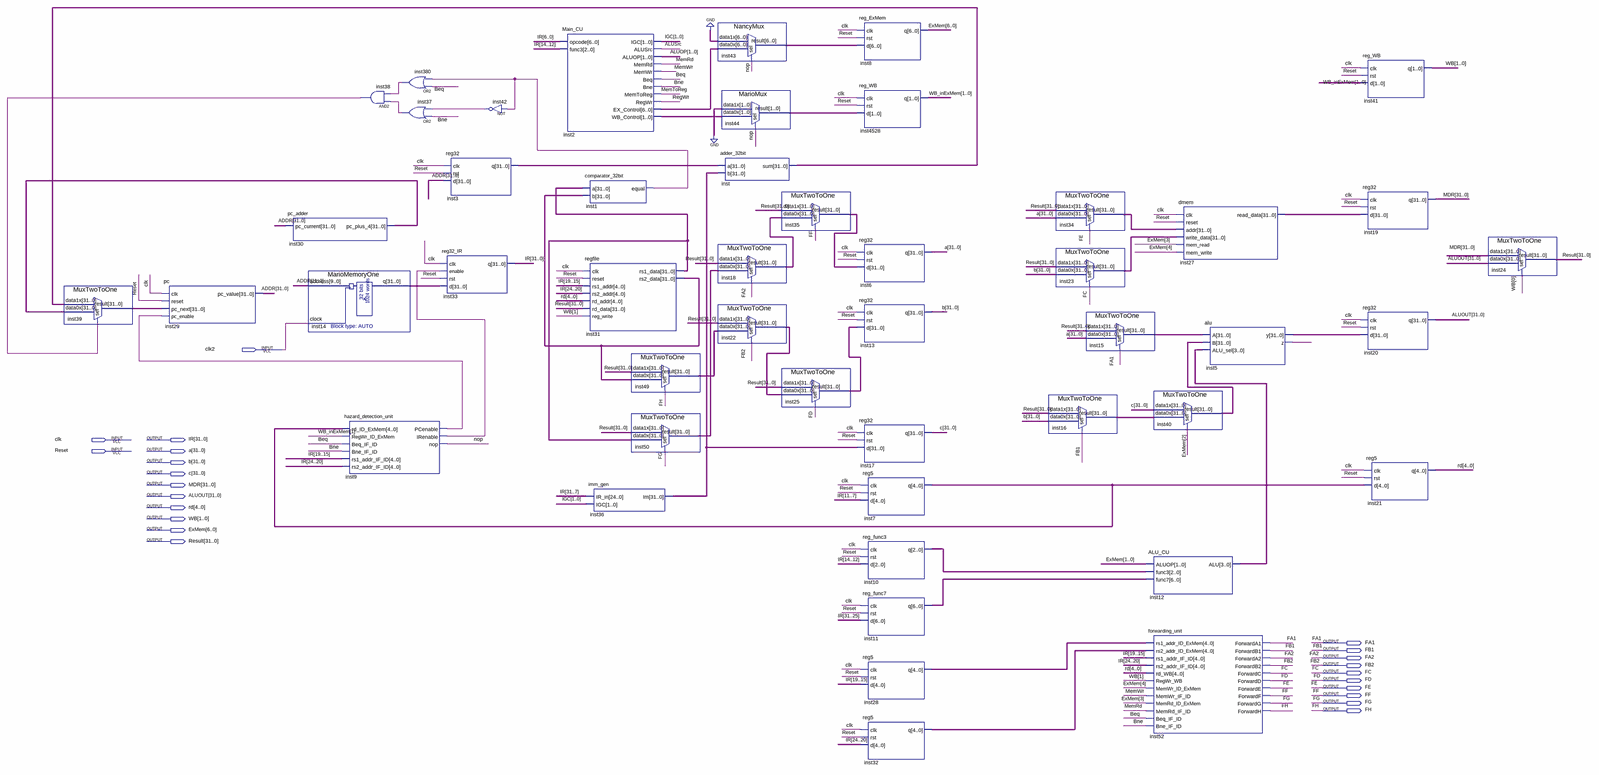
[diagram p0: schematic sheet, whole]
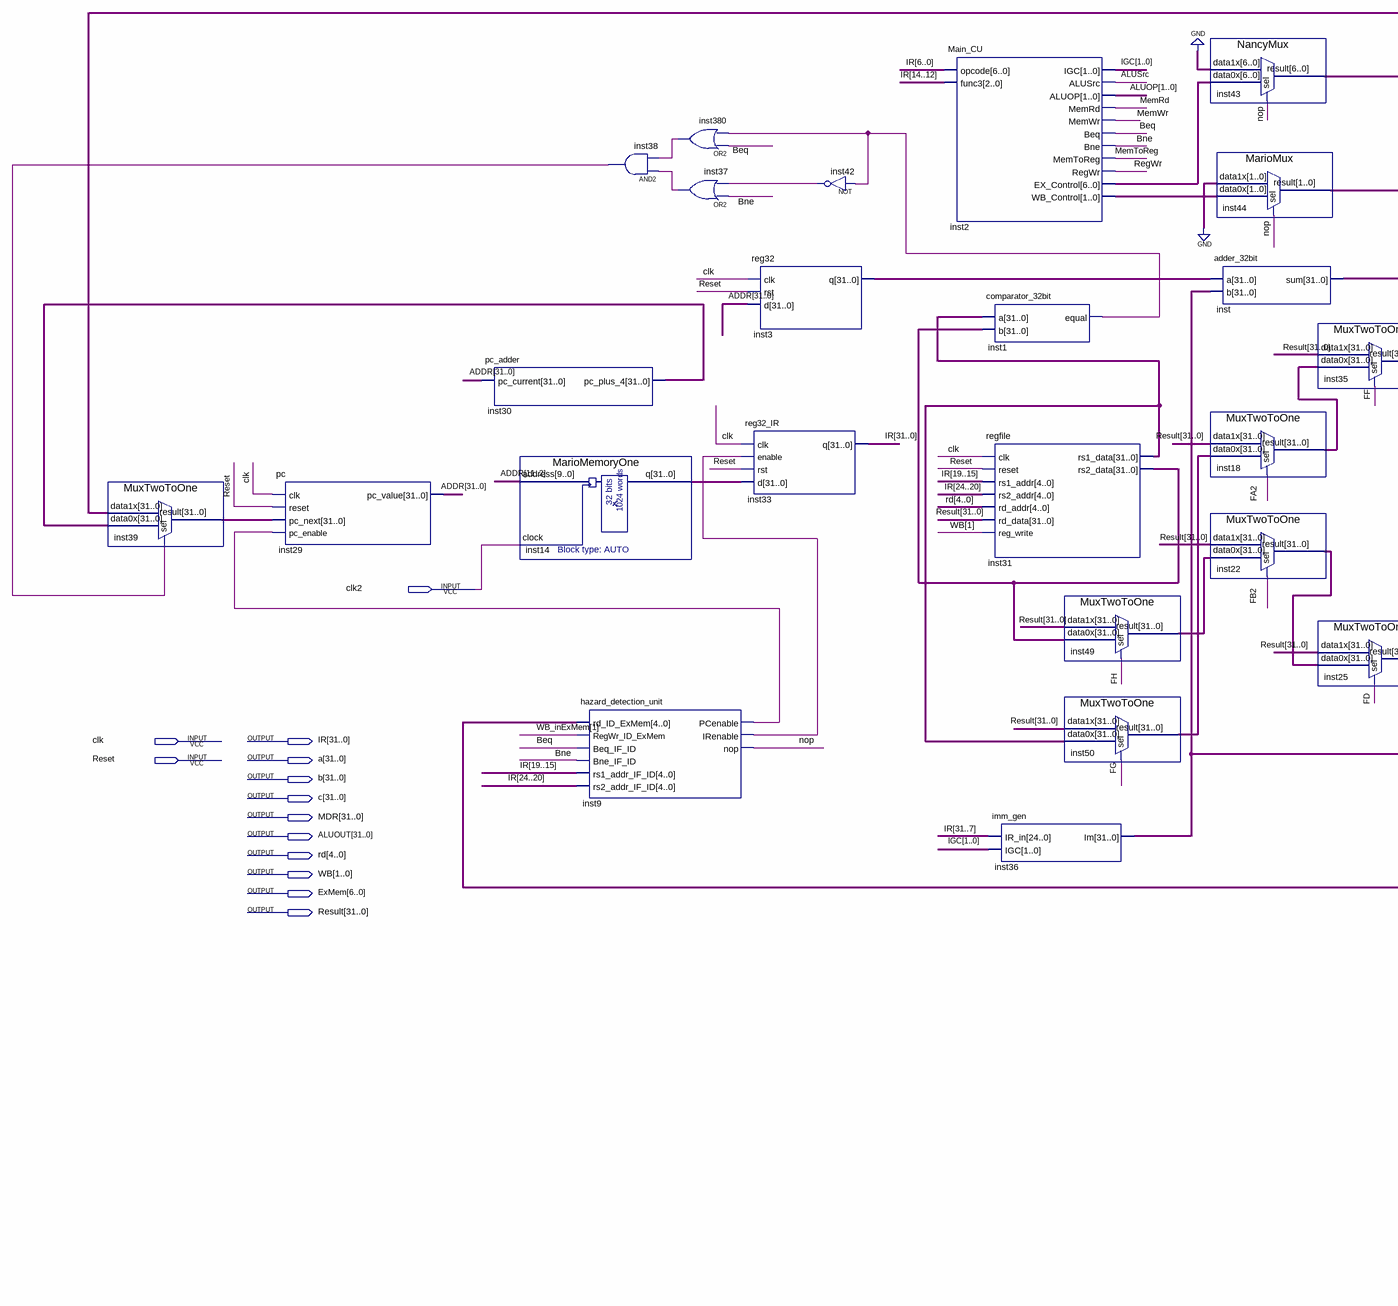
[diagram p1: schematic sheet, left part]
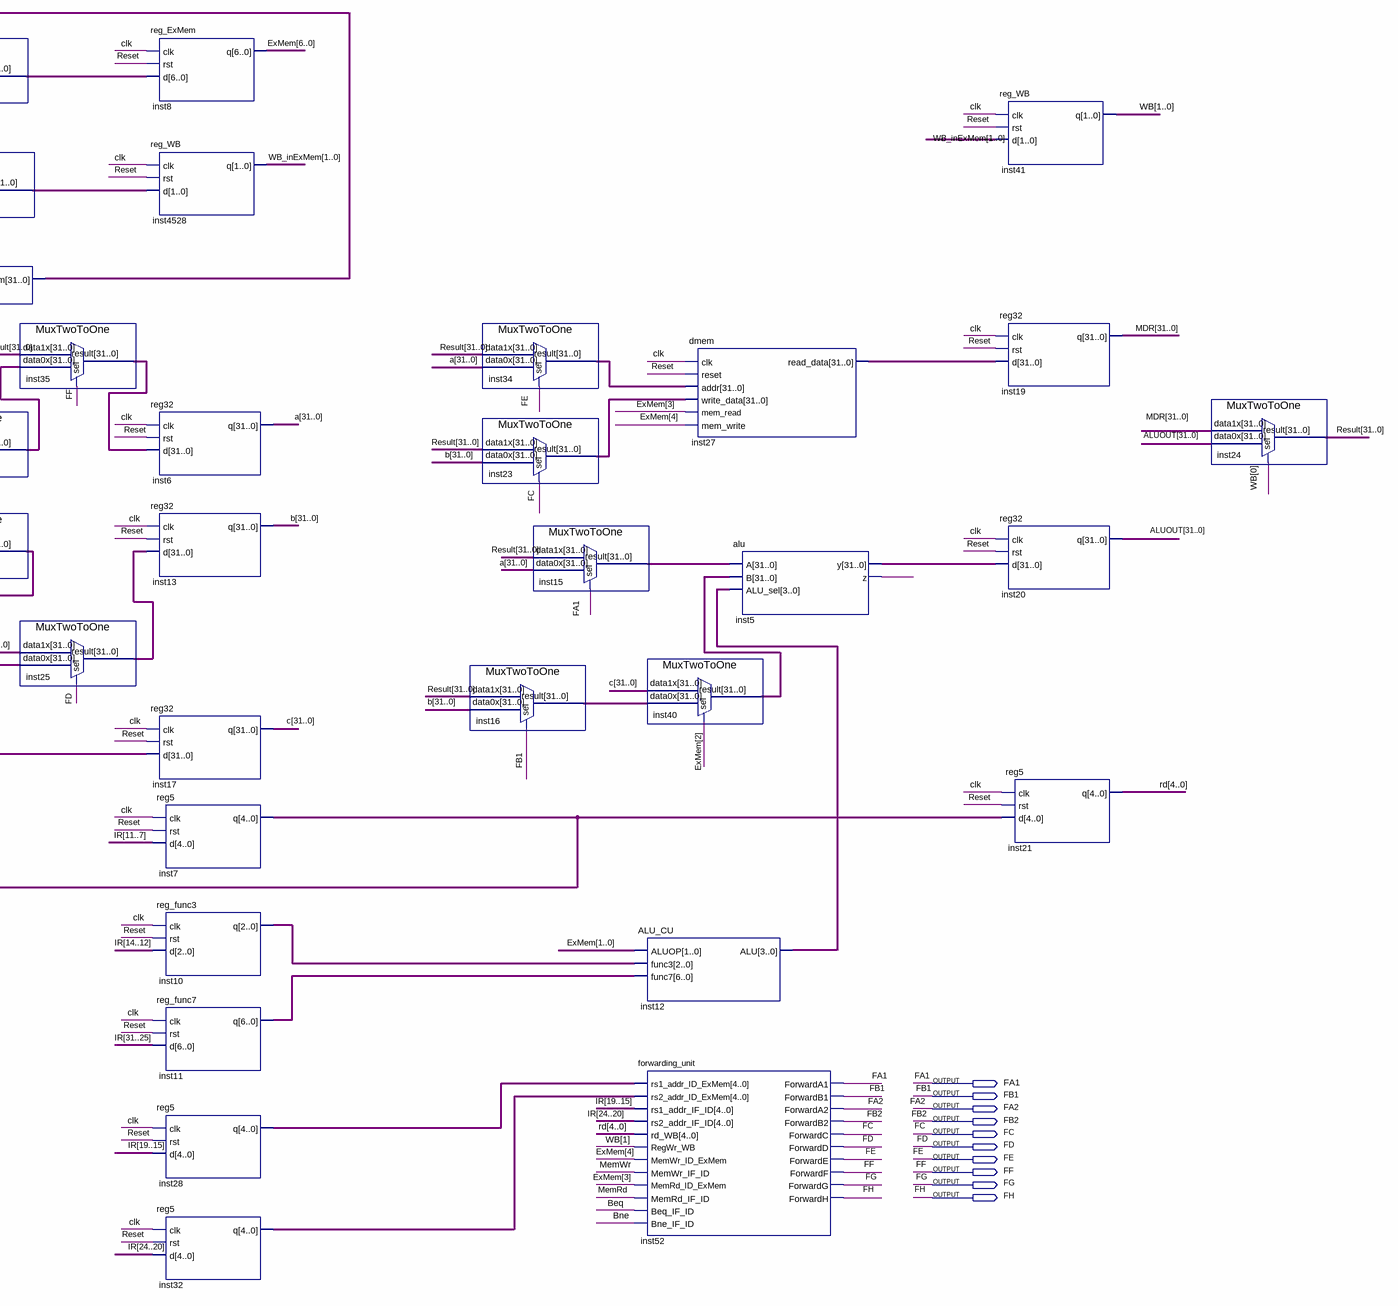
[diagram p2: schematic sheet, right part]
// Quartus schematic Project.bdf as structural Verilog: 48 symbols, 23 pins
module Project (
  input  clk2,
  input  clk,
  input  Reset,
  output [31:0] IR,
  output [31:0] a,
  output [31:0] b,
  output [31:0] c,
  output [31:0] MDR,
  output [31:0] ALUOUT,
  output [4:0] rd,
  output [1:0] WB,
  output [6:0] ExMem,
  output [31:0] Result,
  output FA1,
  output FB1,
  output FA2,
  output FB2,
  output FC,
  output FD,
  output FE,
  output FF,
  output FG,
  output FH
);

  wire ALUSrc, Beq, Bne, inst1_equal, inst5_z, inst9_irenable, inst9_pcenable, inst37_out, inst38_out,
       inst42_out, inst380_out, MemRd, MemToReg, MemWr, nop, RegWr;
  wire [1:0] ALUOP, IGC, inst2_wb_control, inst44_result, WB_inExMem;
  wire [2:0] inst10_q;
  wire [3:0] inst12_alu;
  wire [4:0] inst7_q, inst28_q, inst32_q;
  wire [6:0] inst2_ex_control, inst11_q, inst43_result;
  wire [31:0] ADDR, inst3_q, inst5_y, inst14_q, inst15_result, inst16_result, inst18_result, inst22_result,
       inst23_result, inst25_result, inst27_read_data, inst30_pc_plus_4, inst31_rs1_data, inst31_rs2_data,
       inst34_result, inst35_result, inst36_im, inst39_result, inst40_result, inst49_result, inst50_result,
       inst_sum;

  MuxTwoToOne inst39 (.data1x(inst_sum), .data0x(inst30_pc_plus_4), .sel(inst38_out), .result(inst39_result));
  pc inst29 (.clk(clk), .reset(Reset), .pc_next(inst39_result), .pc_enable(inst9_pcenable), .pc_value(ADDR));
  pc_adder inst30 (.pc_current(ADDR), .pc_plus_4(inst30_pc_plus_4));
  MarioMemoryOne inst14 (.address(ADDR[11:2]), .clock(clk2), .q(inst14_q));
  and inst38 (inst38_out, inst37_out, inst380_out);
  hazard_detection_unit inst9 (
    .rd_ID_ExMem(inst7_q), .RegWr_ID_ExMem(WB_inExMem[1]), .Beq_IF_ID(Beq), .Bne_IF_ID(Bne),
    .rs1_addr_IF_ID(IR[19:15]), .rs2_addr_IF_ID(IR[24:20]), .PCenable(inst9_pcenable),
    .IRenable(inst9_irenable), .nop(nop));
  or inst380 (inst380_out, Beq, inst1_equal);
  or inst37 (inst37_out, Bne, inst42_out);
  reg32 inst3 (.clk(clk), .rst(Reset), .d(ADDR), .q(inst3_q));
  reg32_IR inst33 (.clk(clk), .enable(inst9_irenable), .rst(Reset), .d(inst14_q), .q(IR));
  not inst42 (inst42_out, inst1_equal);
  Main_CU inst2 (
    .opcode(IR[6:0]), .func3(IR[14:12]), .IGC(IGC), .ALUSrc(ALUSrc), .ALUOP(ALUOP), .MemRd(MemRd),
    .MemWr(MemWr), .Beq(Beq), .Bne(Bne), .MemToReg(MemToReg), .RegWr(RegWr), .EX_Control(inst2_ex_control),
    .WB_Control(inst2_wb_control));
  comparator_32bit inst1 (.a(inst31_rs1_data), .b(inst31_rs2_data), .equal(inst1_equal));
  regfile inst31 (
    .clk(clk), .reset(Reset), .rs1_addr(IR[19:15]), .rs2_addr(IR[24:20]), .rd_addr(rd), .rd_data(Result),
    .reg_write(WB[1]), .rs1_data(inst31_rs1_data), .rs2_data(inst31_rs2_data));
  imm_gen inst36 (.IR_in(IR[31:7]), .IGC(IGC), .Im(inst36_im));
  MuxTwoToOne inst49 (.data1x(Result), .data0x(inst31_rs2_data), .sel(FH), .result(inst49_result));
  MuxTwoToOne inst50 (.data1x(Result), .data0x(inst31_rs1_data), .sel(FG), .result(inst50_result));
  NancyMux inst43 (.data1x({7{1'b0}}), .data0x(inst2_ex_control), .sel(nop), .result(inst43_result));
  MarioMux inst44 (.data1x(2'b00), .data0x(inst2_wb_control), .sel(nop), .result(inst44_result));
  adder_32bit inst (.a(inst3_q), .b(inst36_im), .sum(inst_sum));
  MuxTwoToOne inst18 (.data1x(Result), .data0x(inst50_result), .sel(FA2), .result(inst18_result));
  MuxTwoToOne inst22 (.data1x(Result), .data0x(inst49_result), .sel(FB2), .result(inst22_result));
  MuxTwoToOne inst35 (.data1x(Result), .data0x(inst18_result), .sel(FF), .result(inst35_result));
  MuxTwoToOne inst25 (.data1x(Result), .data0x(inst22_result), .sel(FD), .result(inst25_result));
  reg_ExMem inst8 (.clk(clk), .rst(Reset), .d(inst43_result), .q(ExMem));
  reg_WB inst4528 (.clk(clk), .rst(Reset), .d(inst44_result), .q(WB_inExMem));
  reg32 inst6 (.clk(clk), .rst(Reset), .d(inst35_result), .q(a));
  reg32 inst13 (.clk(clk), .rst(Reset), .d(inst25_result), .q(b));
  reg32 inst17 (.clk(clk), .rst(Reset), .d(inst36_im), .q(c));
  reg5 inst7 (.clk(clk), .rst(Reset), .d(IR[11:7]), .q(inst7_q));
  reg_func3 inst10 (.clk(clk), .rst(Reset), .d(IR[14:12]), .q(inst10_q));
  reg_func7 inst11 (.clk(clk), .rst(Reset), .d(IR[31:25]), .q(inst11_q));
  reg5 inst28 (.clk(clk), .rst(Reset), .d(IR[19:15]), .q(inst28_q));
  reg5 inst32 (.clk(clk), .rst(Reset), .d(IR[24:20]), .q(inst32_q));
  MuxTwoToOne inst34 (.data1x(Result), .data0x(a), .sel(FE), .result(inst34_result));
  MuxTwoToOne inst23 (.data1x(Result), .data0x(b), .sel(FC), .result(inst23_result));
  MuxTwoToOne inst16 (.data1x(Result), .data0x(b), .sel(FB1), .result(inst16_result));
  MuxTwoToOne inst15 (.data1x(Result), .data0x(a), .sel(FA1), .result(inst15_result));
  ALU_CU inst12 (.ALUOP(ExMem[1:0]), .func3(inst10_q), .func7(inst11_q), .ALU(inst12_alu));
  forwarding_unit inst52 (
    .rs1_addr_ID_ExMem(inst28_q), .rs2_addr_ID_ExMem(inst32_q), .rs1_addr_IF_ID(IR[19:15]),
    .rs2_addr_IF_ID(IR[24:20]), .rd_WB(rd), .RegWr_WB(WB[1]), .MemWr_ID_ExMem(ExMem[4]), .MemWr_IF_ID(MemWr),
    .MemRd_ID_ExMem(ExMem[3]), .MemRd_IF_ID(MemRd), .Beq_IF_ID(Beq), .Bne_IF_ID(Bne), .ForwardA1(FA1),
    .ForwardB1(FB1), .ForwardA2(FA2), .ForwardB2(FB2), .ForwardC(FC), .ForwardD(FD), .ForwardE(FE),
    .ForwardF(FF), .ForwardG(FG), .ForwardH(FH));
  dmem inst27 (
    .clk(clk), .reset(Reset), .addr(inst34_result), .write_data(inst23_result), .mem_read(ExMem[3]),
    .mem_write(ExMem[4]), .read_data(inst27_read_data));
  MuxTwoToOne inst40 (.data1x(c), .data0x(inst16_result), .sel(ExMem[2]), .result(inst40_result));
  alu inst5 (.A(inst15_result), .B(inst40_result), .ALU_sel(inst12_alu), .y(inst5_y), .z(inst5_z));
  reg_WB inst41 (.clk(clk), .rst(Reset), .d(WB_inExMem), .q(WB));
  reg32 inst19 (.clk(clk), .rst(Reset), .d(inst27_read_data), .q(MDR));
  reg32 inst20 (.clk(clk), .rst(Reset), .d(inst5_y), .q(ALUOUT));
  reg5 inst21 (.clk(clk), .rst(Reset), .d(inst7_q), .q(rd));
  MuxTwoToOne inst24 (.data1x(MDR), .data0x(ALUOUT), .sel(WB[0]), .result(Result));
endmodule
